# Altium schematic sheet EPS_Distribution_RLCL-FPF.SchDoc: Distribution / RLCL-FPF
size A4
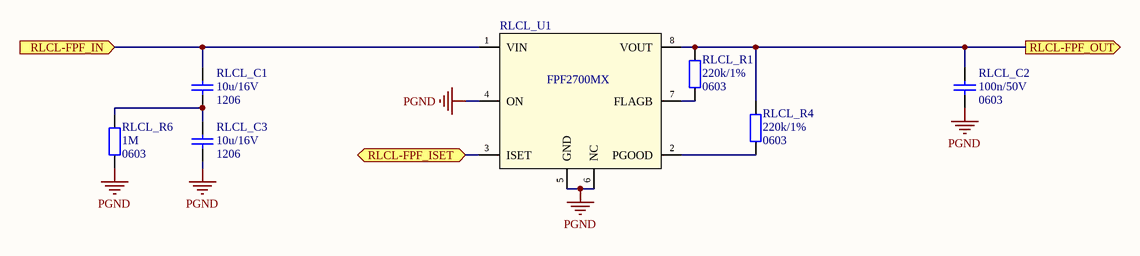
[diagram p0: EPS_Distribution_RLCL-FPF.SchDoc]

## Parts
RLCL_C1  Packge: 1206  [SMD_Capacitor_1206]  (hidden comment: 10u/16V)
RLCL_C2  Package: 0603  [SMD_Capacitor_0603]  (hidden comment: 100n/50V)
RLCL_C3  Packge: 1206  [SMD_Capacitor_1206]  (hidden comment: 10u/16V)
RLCL_R1  Package: 0603  [SMD_Resistor_0603]  (hidden comment: 220k/1%)
RLCL_R4  Package: 0603  [SMD_Resistor_0603]  (hidden comment: 220k/1%)
RLCL_R6  Package: 0603  [SMD_Resistor_0603]  (hidden comment: 1M)
RLCL_U1  FPF2700MX  [SOIC-8-N]

## Ports
RLCL-FPF_IN (in), RLCL-FPF_ISET, RLCL-FPF_OUT (out)

## Nets
PGND: RLCL_C2.2 RLCL_C3.2 RLCL_R6.1 RLCL_U1.4(ON) RLCL_U1.5(GND) RLCL_U1.6(NC)
RLCL-FPF_IN: RLCL_C1.1 RLCL_U1.1(VIN) ; port RLCL-FPF_IN
RLCL-FPF_ISET: RLCL_U1.3(ISET) ; port RLCL-FPF_ISET
RLCL-FPF_OUT: RLCL_C2.1 RLCL_R1.2 RLCL_R4.2 RLCL_U1.8(VOUT) ; port RLCL-FPF_OUT
NetRLCL_C1_2: RLCL_C1.2 RLCL_C3.1 RLCL_R6.2
NetRLCL_R1_1: RLCL_R1.1 RLCL_U1.7(FLAGB)
NetRLCL_R4_1: RLCL_R4.1 RLCL_U1.2(PGOOD)

## Notes on the sheet
- Title:
- Project:
- Author:
- Model:
- Document Number:
- Checked by:
- Rev:
- Date:
- Approved by:
- Sheet:
- of
- File name:

## Library data of the parts
RLCL_C1 RLCL_C3 = Cer_C1206T106K4RACTU: Ceramic Cap Kemet COTS 10u/16V X7R 1206; ManufacturerPartNumber: C1206T106K4RACTU; Manufacturer: Kemet; Value: 10u/16V
RLCL_C2 = Cer_C0603T104K5RALTU: Ceramic Cap Kemet COTS 100n/50V X7R 0603; Manufacturer: Kemet; ManufacturerPartNumber: C0603T104K5RALTU; Value: 100n/50V
RLCL_R1 RLCL_R4 RLCL_R6 = Res
  RLCL_R1 RLCL_R4: Value: 220k/1%
  RLCL_R6: Value: 1M
RLCL_U1 = FPF2700MX: Adj over-current protection 0.4-2A with auto-reset, Load Switch; Manufacturer: Fairchild Semiconductor; Value: FPF2700MX